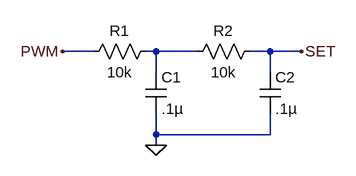
[diagram p0: schematic set_filter.asc]
set_filter.asc, the LTspice schematic file:
Version 4
SHEET 1 880 680
WIRE 96 128 48 128
WIRE 192 128 176 128
WIRE 256 128 192 128
WIRE 368 128 336 128
WIRE 416 128 368 128
WIRE 192 160 192 128
WIRE 368 160 368 128
WIRE 192 256 192 224
WIRE 368 256 368 224
WIRE 368 256 192 256
WIRE 192 272 192 256
FLAG 192 272 0
FLAG 416 128 SET
FLAG 48 128 PWM
SYMBOL res 192 112 R90
WINDOW 0 0 56 VBottom 2
WINDOW 3 32 56 VTop 2
SYMATTR InstName R1
SYMATTR Value 10k
SYMBOL cap 176 160 R0
SYMATTR InstName C1
SYMATTR Value .1µ
SYMBOL res 352 112 R90
WINDOW 0 0 56 VBottom 2
WINDOW 3 32 56 VTop 2
SYMATTR InstName R2
SYMATTR Value 10k
SYMBOL cap 352 160 R0
SYMATTR InstName C2
SYMATTR Value .1µ

The netlist it stands for:
* set_filter.asc
R1 N001 PWM 10k
C1 N001 0 .1µ
R2 SET N001 10k
C2 SET 0 .1µ
.backanno
.end